# Altium schematic sheet Sheet1.SchDoc
size A4; SheetNumber: 1; SheetTotal: 1
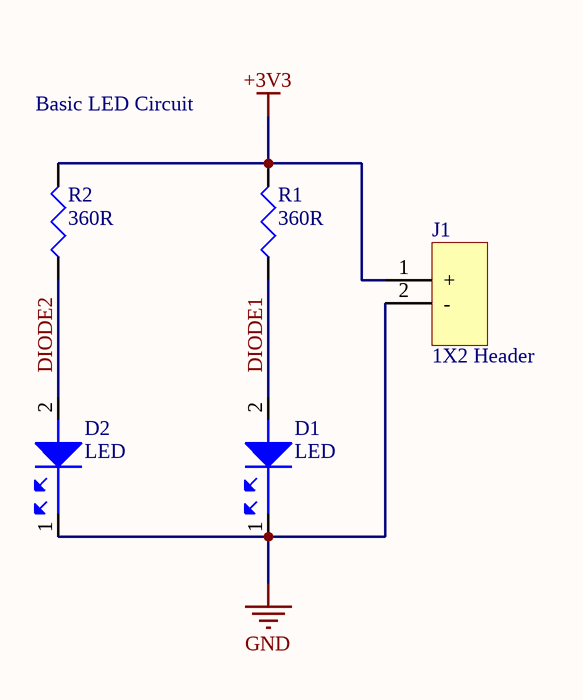
[diagram p0: Sheet1.SchDoc]

## Parts
D1  LED  [LED0603G]
D2  LED  [LED0603G]
J1  1X2 Header  [HDR1X2]
R1  360R  [R0805]
R2  360R  [R0805]

## Nets
+3V3: J1.1(+) R1.2 R2.2
GND: D1.1 D2.1 J1.2(-)
DIODE1: D1.2 R1.1
DIODE2: D2.2 R2.1

## Notes on the sheet
- Basic LED Circuit

## Library data of the parts
D1 D2 = LNJ826W83RA: SC, VISIBLE LED SMD-Thin USS,InGaAlP,Hi Brt Orange; Manufacturer 1: Panasonic; Luminous Intensity: 19mcd; Forward Voltage: 1.9V; Wavelength: 627nm; Forward Current: 5mA; Dominant Wavelength: 620nm; Lens Style: Rectangular; Number of LEDs: 1; Supplier 1: Digi-Key; Supplier Part Number 1: P13487CT-ND; Manufacturer Part Number 1: LNJ826W83RA; RoHS: Yes; Category: LEDs; Stock 1: 10247; Pricing 1: 1=0,33000, 10=0,21700, 100=0,15580, 500=0,13068, 1000=0,12276 (USD); Mount: Surface Mount; Case/Package: 0603; Number of Pins: 2; Color: Orange; Case Code (Metric): 1608; Case Code (Imperial): 0603; Min Operating Temperature: -30°C; Max Operating Temperature: 85°C; Packaging: Tape and Reel; Package Quantity: 1; Illumination Color: Orange; Test Current: 5mA; Series: LN; Length: 1.6mm; Width: 0.8mm; Height: 0.43mm; Radiation Hardening: No; REACH SVHC: Yes; Lead Free: Lead Free; RoHS Compliant: Yes; ComponentLink1URL: https://datasheet.ciiva.com/4688/lnj826w83ra-cek-225979-4688595.pdf?src-supplier=Mouser; ComponentLink1Description: https://datasheet.ciiva.com/4688/lnj826w83ra-cek-225979-4688595.pdf?src-supplier=Mouser; ComponentLink2URL: https://datasheet.ciiva.com/9326/lnj826w83ra-cek-9326754.pdf?src-supplier=Avnet; ComponentLink2Description: https://datasheet.ciiva.com/9326/lnj826w83ra-cek-9326754.pdf?src-supplier=Avnet; ComponentLink3URL: https://datasheet.ciiva.com/11775/0900766b80f0a8c4-11775398.pdf?src-supplier=RSComponents; ComponentLink3Description: https://datasheet.ciiva.com/11775/0900766b80f0a8c4-11775398.pdf?src-supplier=RSComponents; ComponentLink4URL: https://datasheet.ciiva.com/5685/340520-5685541.pdf?src-supplier=Farnell; ComponentLink4Description: https://datasheet.ciiva.com/5685/340520-5685541.pdf?src-supplier=Farnell; ComponentLink5URL: https://datasheet.ciiva.com/5685/340520-5685543.pdf?src-supplier=Farnell; ComponentLink5Description: https://datasheet.ciiva.com/5685/340520-5685543.pdf?src-supplier=Farnell
J1 = 22-29-2021: CONN HEADER VERT 2POS 2.54MM; Manufacturer 1: Molex; Number of Positions: 2; Connector Type: Header,Male Pin; Gender: Male; Voltage Rating (DC): 250V; Contact Post Length: 0.14inch; Glow Wire Compliant: Non-compliant; Supplier 1: Digi-Key; Supplier Part Number 1: WM2744-ND; Manufacturer Part Number 1: 22-29-2021; RoHS: Yes; Category: Headers and Wire Housings; Stock 1: 16163; Pricing 1: 1=0,48000, 10=0,40400, 100=0,31400, 1000=0,24671, 5000=0,21680, 10000=0,20185 (USD); Mount: Through Hole; Housing Color: Natural; Color: White; Contact Plating: Gold; Contact Material: Tin; Contact Shape: Square; Insulation Material: Nylon; Insulation Color: Natural; Max Operating Temperature: 80°C; Number of Rows: 1; Packaging: Bulk; Termination: Through Hole; Series: 6410; Contact Type: -; Package Quantity: 24000; Fastening Type: Friction; Contact Mating Length: 0.295inch; Insulation Height: 0.461inch; Lead Free: Lead Free; Flammability Rating: UL94 V-0; Halogen Free: Low Halogen; ComponentLink1URL: https://datasheet.ciiva.com/70131/022292021-sd-70131706.pdf?src-supplier=Digi-Key; ComponentLink1Description: https://datasheet.ciiva.com/70131/022292021-sd-70131706.pdf?src-supplier=Digi-Key
R1 R2 = CRCW0805360RFKEAHP: RES SMD 360 OHM 1% 1/2W 0805; Manufacturer 1: Vishay Dale; Max Power Dissipation: 500mW; Temperature Coefficient: 100ppm/°C; Supplier 1: Digi-Key; Supplier Part Number 1: CRCW0805360RFKEAHP-ND; Manufacturer Part Number 1: CRCW0805360RFKEAHP; RoHS: Yes; Category: Chip SMD Resistors; Stock 1: 5000; Pricing 1: 5000=0,03019, 10000=0,02818 (USD); Case/Package: 0805; Contact Plating: Tin; Min Operating Temperature: -55°C; Max Operating Temperature: 155°C; Package Quantity: 5000; Resistance: 360R; Tolerance: 1%; Packaging: Tape and Reel; Resistor Type: Thick Film; Number of Terminations: 2; Features: Automotive AEC-Q200; Series: CRCW-HP; Length: 0.079inch; Width: 0.049inch; Height: 0.024inch; Radiation Hardening: No; Lead Free: Lead Free; RoHS Compliant: Yes; ComponentLink1URL: https://datasheet.ciiva.com/2581/crcwhpe3-2581493.pdf?src-supplier=Digi-Key; ComponentLink1Description: https://datasheet.ciiva.com/2581/crcwhpe3-2581493.pdf?src-supplier=Digi-Key; ComponentLink2URL: https://datasheet.ciiva.com/8898/crcwhpe3-8898911.pdf?src-supplier=Avnet; ComponentLink2Description: https://datasheet.ciiva.com/8898/crcwhpe3-8898911.pdf?src-supplier=Avnet